# Altium schematic sheet power_24V.SchDoc: Power 24V
size A4; Organization: Badgerloop Electrical; Address1: 133 Engineering Research Building; Address2: 1500 Engineering Drive; Address3: Madison, Wi 53706
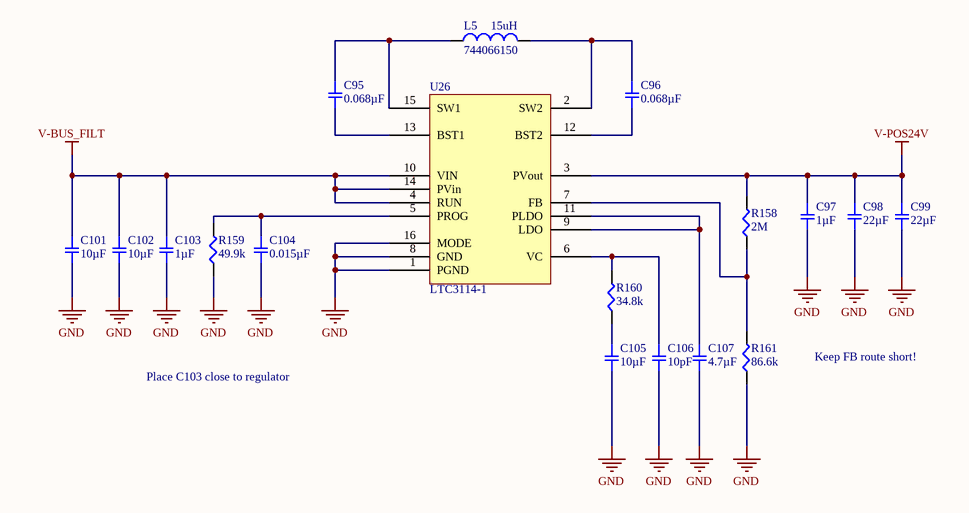
[diagram p0: power_24V.SchDoc]

## Parts
C95  0.068µF  [SMD-0805C]
C96  0.068µF  [SMD-0805C]
C97  1µF  [SMD-0805C]
C98  22µF  [SMD-1206C]
C99  22µF  [SMD-1206C]
C101  10µF  [SMD-1206C]
C102  10µF  [SMD-1206C]
C103  1µF  [SMD-1206C]
C104  0.015µF  [SMD-0805C]
C105  10µF  [SMD-1206C]
C106  10pF  [SMD-0805C]
C107  4.7µF  [SMD-1206C]
L5  744066150  Inductance: 15uH  [INDP100100X38N]
R158  2M  [SMD-0805-RES]
R159  49.9k  [SMD-0805-RES]
R160  34.8k  [SMD-0805-RES]
R161  86.6k  [SMD-0805-RES]
U26  LTC3114-1  [TSOP65P640X110_HS-17N]

## Nets
GND: C97.2 C98.2 C99.2 C101.2 C102.2 C103.2 C104.2 C105.2 C106.2 C107.2 R159.1 R161.1 U26.1(PGND) U26.8(GND) U26.16(MODE)
V-BUS_FILT: C101.1 C102.1 C103.1 U26.4(RUN) U26.10(VIN) U26.14(PVin)
V-POS24V: C97.1 C98.1 C99.1 R158.2 U26.3(PVout)
NetC95_1: C95.1 L5.1 U26.15(SW1)
NetC95_2: C95.2 U26.13(BST1)
NetC96_1: C96.1 L5.2 U26.2(SW2)
NetC96_2: C96.2 U26.12(BST2)
NetC104_1: C104.1 R159.2 U26.5(PROG)
NetC105_1: C105.1 R160.1
NetC106_1: C106.1 R160.2 U26.6(VC)
NetC107_1: C107.1 U26.9(LDO) U26.11(PLDO)
NetR158_1: R158.1 R161.2 U26.7(FB)

## Notes on the sheet
- Place C103 close to regulator
- Keep FB route short!
- Title
- Engineer:
- Date:
- Time:
- Revision:
- Sheet
- of
- File:

## Library data of the parts
C95 C96 = GCJ21BR71H683KA01L: CAP CER 0.068UF 50V X7R 0805; Manufacturer: Murata Electronics North America; Factory Stock: 0; Unit Price (USD): 0.24; Minimum Quantity: 1; Tolerance: ±10%; Datasheets: http://www.murata.com/~/media/webrenewal/support/library/catalog/products/capacitor/mlcc/c03e.ashx; Image: //media.digikey.com/Renders/Murata%20Renders/0805%20(2012%20Metric)%20.85mm.jpg; Digi-Key Part Number: 490-5807-1-ND; Part Number: GCJ21BR71H683KA01L; Quantity Available: 4490; @ qty: 0; Packaging: Cut Tape (CT); Series: GCJ; Part Status: Active; Value: 0.068µF; Voltage: 50V; Temperature Coefficient: X7R; Operating Temperature: -55°C ~ 125°C; Features: Soft Termination; Ratings: AEC-Q200; Applications: Automotive, Boardflex Sensitive; Mounting Type: Surface Mount, MLCC; Package / Case: 0805 (2012 Metric); Size / Dimension: 0.079" L x 0.049" W (2.00mm x 1.25mm); Height - Seated (Max): -; Thickness (Max): 0.057" (1.45mm); Lead Spacing: -; Lead Style: -
C97 = GCJ21BR71H105KA01L: CAP CER 1UF 50V X7R 0805; Manufacturer: Murata Electronics North America; Factory Stock: 0; Unit Price (USD): 0.33; Minimum Quantity: 1; Tolerance: ±10%; Datasheets: http://www.murata.com/~/media/webrenewal/support/library/catalog/products/capacitor/mlcc/c03e.ashx; Image: //media.digikey.com/Renders/Murata%20Renders/0805%20(2012%20Metric)%20.85mm.jpg; Digi-Key Part Number: 490-10667-1-ND; Part Number: GCJ21BR71H105KA01L; Quantity Available: 55137; @ qty: 0; Packaging: Cut Tape (CT); Series: GCJ; Part Status: Active; Value: 1µF; Voltage: 50V; Temperature Coefficient: X7R; Operating Temperature: -55°C ~ 125°C; Features: Soft Termination; Ratings: AEC-Q200; Applications: Automotive, Boardflex Sensitive; Mounting Type: Surface Mount, MLCC; Package / Case: 0805 (2012 Metric); Size / Dimension: 0.079" L x 0.049" W (2.00mm x 1.25mm); Height - Seated (Max): -; Thickness (Max): 0.057" (1.45mm); Lead Spacing: -; Lead Style: -
C98 C99 = GRM31CR61E226KE15L: CAP CER 22UF 25V X5R 1206; Manufacturer: Murata Electronics North America; Factory Stock: 0; Unit Price (USD): 0.56; Minimum Quantity: 1; Tolerance: ±10%; Datasheets: http://www.murata.com/~/media/webrenewal/support/library/catalog/products/capacitor/mlcc/c02e.pdf; Image: //media.digikey.com/Renders/Murata%20Renders/GR331BD72E473KW01L.jpg; Digi-Key Part Number: 490-5527-1-ND; Part Number: GRM31CR61E226KE15L; Quantity Available: 524412; @ qty: 0; Packaging: Cut Tape (CT); Series: GRM; Part Status: Active; Value: 22µF; Voltage: 25V; Temperature Coefficient: X5R; Operating Temperature: -55°C ~ 85°C; Features: -; Ratings: -; Applications: General Purpose; Mounting Type: Surface Mount, MLCC; Package / Case: 1206 (3216 Metric); Size / Dimension: 0.126" L x 0.063" W (3.20mm x 1.60mm); Height - Seated (Max): -; Thickness (Max): 0.071" (1.80mm); Lead Spacing: -; Lead Style: -
C101 C102 C105 = GRM31CR61H106KA12L: CAP CER 10UF 50V X5R 1206; Manufacturer: Murata Electronics North America; Factory Stock: 0; Unit Price (USD): 0.65; Minimum Quantity: 1; Tolerance: ±10%; Datasheets: http://www.murata.com/~/media/webrenewal/support/library/catalog/products/capacitor/mlcc/c02e.pdf; Image: //media.digikey.com/Renders/Murata%20Renders/GR331BD72E473KW01L.jpg; Digi-Key Part Number: 490-5961-1-ND; Part Number: GRM31CR61H106KA12L; Quantity Available: 86736; @ qty: 0; Packaging: Cut Tape (CT); Series: GRM; Part Status: Active; Value: 10µF; Voltage: 50V; Temperature Coefficient: X5R; Operating Temperature: -55°C ~ 85°C; Features: -; Ratings: -; Applications: General Purpose; Mounting Type: Surface Mount, MLCC; Package / Case: 1206 (3216 Metric); Size / Dimension: 0.126" L x 0.063" W (3.20mm x 1.60mm); Height - Seated (Max): -; Thickness (Max): 0.071" (1.80mm); Lead Spacing: -; Lead Style: -
C103 = GCJ31MR71H105KA12L: CAP CER 1UF 50V X7R 1206; Manufacturer: Murata Electronics North America; Factory Stock: 0; Unit Price (USD): 0.32; Minimum Quantity: 1; Tolerance: ±10%; Datasheets: http://www.murata.com/~/media/webrenewal/support/library/catalog/products/capacitor/mlcc/c03e.ashx; Image: //media.digikey.com/Renders/Murata%20Renders/GR331BD72E473KW01L.jpg; Digi-Key Part Number: 490-5810-1-ND; Part Number: GCJ31MR71H105KA12L; Quantity Available: 38710; @ qty: 0; Packaging: Cut Tape (CT); Series: GCJ; Part Status: Active; Value: 1µF; Voltage: 50V; Temperature Coefficient: X7R; Operating Temperature: -55°C ~ 125°C; Features: Soft Termination; Ratings: AEC-Q200; Applications: Automotive, Boardflex Sensitive; Mounting Type: Surface Mount, MLCC; Package / Case: 1206 (3216 Metric); Size / Dimension: 0.126" L x 0.063" W (3.20mm x 1.60mm); Height - Seated (Max): -; Thickness (Max): 0.053" (1.35mm); Lead Spacing: -; Lead Style: -
C104 = GC321AD72E153KX01D: CAP CER 0.015UF 250V X7T 0805; Manufacturer: Murata Electronics North America; Factory Stock: 0; Unit Price (USD): 0.27; Minimum Quantity: 1; Tolerance: ±10%; Datasheets: http://search.murata.co.jp/Ceramy/image/img/A01X/G101/ENG/GC321AD72E153KX01-01.pdf; Image: //media.digikey.com/Renders/Murata%20Renders/0805(GC3)200x125.jpg; Digi-Key Part Number: 490-13987-1-ND; Part Number: GC321AD72E153KX01D; Quantity Available: 4000; @ qty: 0; Packaging: Cut Tape (CT); Series: GC3; Part Status: Active; Value: 0.015µF; Voltage: 250V; Temperature Coefficient: X7T; Operating Temperature: -55°C ~ 125°C; Features: -; Ratings: AEC-Q200; Applications: Automotive; Mounting Type: Surface Mount, MLCC; Package / Case: 0805 (2012 Metric); Size / Dimension: 0.079" L x 0.049" W (2.00mm x 1.25mm); Height - Seated (Max): -; Thickness (Max): 0.039" (1.00mm); Lead Spacing: -; Lead Style: -
C106 = GQM2195C2A100GB01D: CAP CER 10PF 100V NP0 0805; Manufacturer: Murata Electronics North America; Factory Stock: 0; Unit Price (USD): 0.91; Minimum Quantity: 1; Tolerance: ±2%; Temperature Coefficient: C0G, NP0; Datasheets: http://www.murata.com/~/media/webrenewal/support/library/catalog/products/capacitor/mlcc/c02e.pdf; Image: //media.digikey.com/Renders/Murata%20Renders/0805(GxM9).jpg; Digi-Key Part Number: 490-6098-1-ND; Part Number: GQM2195C2A100GB01D; Quantity Available: 3211; @ qty: 0; Packaging: Cut Tape (CT); Series: GQM; Part Status: Active; Value: 10pF; Voltage: 100V; Operating Temperature: -55°C ~ 125°C; Features: High Q, Low Loss; Ratings: -; Applications: RF, Microwave, High Frequency; Mounting Type: Surface Mount, MLCC; Package / Case: 0805 (2012 Metric); Size / Dimension: 0.079" L x 0.049" W (2.00mm x 1.25mm); Height - Seated (Max): -; Thickness (Max): 0.037" (0.95mm); Lead Spacing: -; Lead Style: -
C107 = GCM31CC71H475KA03L: CAP CER 4.7UF 50V X7S 1206; Manufacturer: Murata Electronics North America; Factory Stock: 0; Unit Price (USD): 0.57; Minimum Quantity: 1; Tolerance: ±10%; Datasheets: http://www.murata.com/~/media/webrenewal/support/library/catalog/products/capacitor/mlcc/c03e.ashx; Image: //media.digikey.com/Renders/Murata%20Renders/GR331BD72E473KW01L.jpg; Digi-Key Part Number: 490-11167-1-ND; Part Number: GCM31CC71H475KA03L; Quantity Available: 11700; @ qty: 0; Packaging: Cut Tape (CT); Series: GCM; Part Status: Active; Value: 4.7µF; Voltage: 50V; Temperature Coefficient: X7S; Operating Temperature: -55°C ~ 125°C; Features: -; Ratings: AEC-Q200; Applications: Automotive; Mounting Type: Surface Mount, MLCC; Package / Case: 1206 (3216 Metric); Size / Dimension: 0.126" L x 0.063" W (3.20mm x 1.60mm); Height - Seated (Max): -; Thickness (Max): 0.071" (1.80mm); Lead Spacing: -; Lead Style: -
L5 = 744066150: FIXED IND 15UH 3.2A 50 MOHM SMD; Manufacturer: Wurth Electronics; Core Material: Ferrite; Saturation Current: 3.25A; Tolerance: 30%; Shielding: Shielded; Self Resonant Frequency: 16MHz; DC Resistance (DCR): 50mR; Test Frequency: 100kHz; Supplier 1: Digi-Key; Manufacturer Part Number: 744066150; Stock 1: 1755; Pricing 1: 1=1.94000, 10=1.88200, 50=1.64600, 100=1.50500 (USD); RoHS: Yes; Mount: Surface Mount; Case/Package: Nonstandard; Weight: 0.044904oz; Min Operating Temperature: -40°C; Max Operating Temperature: 125°C; Package Quantity: 800; Current Rating: 3.2A; Packaging: Cut Tape; Inductance Tolerance: 30%; Composition: Wirewound; Max DC Current: 3.2A; Termination: SMD/SMT; RMS Current (Irms): 3.2A; Series Resistance: 50mR; Length: 10mm; Height: 3.8mm; Width: 10mm; Height - Seated (Max): 0.161inch; Depth: 10mm; REACH SVHC: Unknown; Lead Free: Lead Free; ComponentLink1URL: https://datasheet.ciiva.com/1051/744066150-1051985.pdf?src-supplier=Digi-Key; ComponentLink1Description: https://datasheet.ciiva.com/1051/744066150-1051985.pdf?src-supplier=Digi-Key; ComponentLink2URL: https://datasheet.ciiva.com/7892/1735619-7892648.pdf?src-supplier=Element14; ComponentLink2Description: https://datasheet.ciiva.com/7892/1735619-7892648.pdf?src-supplier=Element14; ComponentLink3URL: https://datasheet.ciiva.com/11803/0900766b80febc54-11803273.pdf?src-supplier=RSComponents; ComponentLink3Description: https://datasheet.ciiva.com/11803/0900766b80febc54-11803273.pdf?src-supplier=RSComponents; ComponentLink4URL: https://datasheet.ciiva.com/13320/744066150-67363-13320654.pdf?src-supplier=Mouser; ComponentLink4Description: https://datasheet.ciiva.com/13320/744066150-67363-13320654.pdf?src-supplier=Mouser; ComponentLink5URL: https://datasheet.ciiva.com/1051/744066150-1051986.pdf?src-supplier=Digi-Key; ComponentLink5Description: https://datasheet.ciiva.com/1051/744066150-1051986.pdf?src-supplier=Digi-Key; ComponentLink6URL: https://datasheet.ciiva.com/1051/744066150-1051987.pdf?src-supplier=Digi-Key; ComponentLink6Description: https://datasheet.ciiva.com/1051/744066150-1051987.pdf?src-supplier=Digi-Key; ComponentLink7URL: https://datasheet.ciiva.com/14123/744066150-ch-ger-eng-ds-14123723.pdf?src-supplier=Distrelec; ComponentLink7Description: https://datasheet.ciiva.com/14123/744066150-ch-ger-eng-ds-14123723.pdf?src-supplier=Distrelec; Supplier Part Number 1: 732-1077-1-ND
R158 = ERJ-6ENF2004V: RES SMD 2M OHM 1% 1/8W 0805; Manufacturer: Panasonic Electronic Components; Factory Stock: 0; Unit Price (USD): 0.00729; @ qty: 1500; Minimum Quantity: 1; Power (Watts): 0.125W, 1/8W; Temperature Coefficient: ±100ppm/°C; Part Number: ERJ-6ENF2004V; Datasheets: http://industrial.panasonic.com/www-cgi/jvcr13pz.cgi?E+PZ+3+AOA0002+ERJ6ENF2004V+7+WW; Image: //media.digikey.com/Renders/Panasonic%20Renders/ERJ-0805%20Pkg.jpg; Digi-Key Part Number: P2.00MCCT-ND; Quantity Available: 31894; Packaging: Cut Tape (CT); Series: ERJ; Part Status: Active; Value: 2M; Tolerance: ±1%; Composition: Thick Film; Features: Automotive AEC-Q200; Operating Temperature: -55°C ~ 155°C; Package / Case: 0805 (2012 Metric); Supplier Device Package: 0805; Size / Dimension: 0.079" L x 0.049" W (2.00mm x 1.25mm); Height - Seated (Max): 0.028" (0.70mm); Number of Terminations: 2; Failure Rate: -
R159 = ERJ-6ENF4992V: RES SMD 49.9K OHM 1% 1/8W 0805; Manufacturer: Panasonic Electronic Components; Factory Stock: 0; Unit Price (USD): 0.00729; @ qty: 1500; Minimum Quantity: 1; Power (Watts): 0.125W, 1/8W; Temperature Coefficient: ±100ppm/°C; Part Number: ERJ-6ENF4992V; Datasheets: http://industrial.panasonic.com/www-cgi/jvcr13pz.cgi?E+PZ+3+AOA0002+ERJ6ENF4992V+7+WW; Image: //media.digikey.com/Renders/Panasonic%20Renders/ERJ-0805%20Pkg.jpg; Digi-Key Part Number: P49.9KCCT-ND; Quantity Available: 165139; Packaging: Cut Tape (CT); Series: ERJ; Part Status: Active; Value: 49.9k; Tolerance: ±1%; Composition: Thick Film; Features: Automotive AEC-Q200; Operating Temperature: -55°C ~ 155°C; Package / Case: 0805 (2012 Metric); Supplier Device Package: 0805; Size / Dimension: 0.079" L x 0.049" W (2.00mm x 1.25mm); Height - Seated (Max): 0.028" (0.70mm); Number of Terminations: 2; Failure Rate: -
R160 = ERJ-6ENF3482V: RES SMD 34.8K OHM 1% 1/8W 0805; Manufacturer: Panasonic Electronic Components; Factory Stock: 0; Unit Price (USD): 0.00729; @ qty: 1500; Minimum Quantity: 1; Power (Watts): 0.125W, 1/8W; Temperature Coefficient: ±100ppm/°C; Part Number: ERJ-6ENF3482V; Datasheets: http://industrial.panasonic.com/www-cgi/jvcr13pz.cgi?E+PZ+3+AOA0002+ERJ6ENF3482V+7+WW; Image: //media.digikey.com/Renders/Panasonic%20Renders/ERJ-0805%20Pkg.jpg; Digi-Key Part Number: P34.8KCCT-ND; Quantity Available: 31955; Packaging: Cut Tape (CT); Series: ERJ; Part Status: Active; Value: 34.8k; Tolerance: ±1%; Composition: Thick Film; Features: Automotive AEC-Q200; Operating Temperature: -55°C ~ 155°C; Package / Case: 0805 (2012 Metric); Supplier Device Package: 0805; Size / Dimension: 0.079" L x 0.049" W (2.00mm x 1.25mm); Height - Seated (Max): 0.028" (0.70mm); Number of Terminations: 2; Failure Rate: -
R161 = ERJ-6ENF8662V: RES SMD 86.6K OHM 1% 1/8W 0805; Manufacturer: Panasonic Electronic Components; Factory Stock: 0; Unit Price (USD): 0.00729; @ qty: 1500; Minimum Quantity: 1; Power (Watts): 0.125W, 1/8W; Temperature Coefficient: ±100ppm/°C; Part Number: ERJ-6ENF8662V; Datasheets: http://industrial.panasonic.com/www-cgi/jvcr13pz.cgi?E+PZ+3+AOA0002+ERJ6ENF8662V+7+WW; Image: //media.digikey.com/Renders/Panasonic%20Renders/ERJ-0805%20Pkg.jpg; Digi-Key Part Number: P86.6KCCT-ND; Quantity Available: 23872; Packaging: Cut Tape (CT); Series: ERJ; Part Status: Active; Value: 86.6k; Tolerance: ±1%; Composition: Thick Film; Features: Automotive AEC-Q200; Operating Temperature: -55°C ~ 155°C; Package / Case: 0805 (2012 Metric); Supplier Device Package: 0805; Size / Dimension: 0.079" L x 0.049" W (2.00mm x 1.25mm); Height - Seated (Max): 0.028" (0.70mm); Number of Terminations: 2; Failure Rate: -
U26 = LTC3114-1: Manufacturer: Analog Devices / Linear Technology; Manufacturer Part Number: LTC3114EFE-1#TRPBF; Number of Outputs: 1; Min Input Voltage: 2.2V; Max Input Voltage: 40V; Min Output Voltage: 2.7V; Output Current: 1A; Switching Frequency: 1.2MHz; Synchronous Rectifier: Yes; Efficiency: 96%; Topology: Buck-Boost; Output Type: Adjustable; Output Configuration: Positive; Supplier 1: Digi-Key; Stock 1: 2151; Pricing 1: 1=10.01000, 25=7.35000, 100=5.49400, 250=5.21932, 500=5.10160 (USD); RoHS: Yes; Mount: Surface Mount; Case/Package: TSSOP; Number of Pins: 16; Min Operating Temperature: -40°C; Max Operating Temperature: 125°C; Packaging: Tape and Reel; Max Output Voltage: 40V; Output Voltage: 2.7V; ComponentLink1URL: http://components.arrow.com/part/dataview/66446920S858405N7433?src-supplier=Arrow; ComponentLink1Description: http://components.arrow.com/part/dataview/66446920S858405N7433?src-supplier=Arrow; ComponentLink2URL: http://www.linear.com/docs/44756?src-supplier=Digi-Key; ComponentLink2Description: http://www.linear.com/docs/44756?src-supplier=Digi-Key; Supplier Part Number 1: LTC3114EFE-1#TRPBFCT-ND